# Altium schematic sheet LED_Fret.SchDoc
size Letter
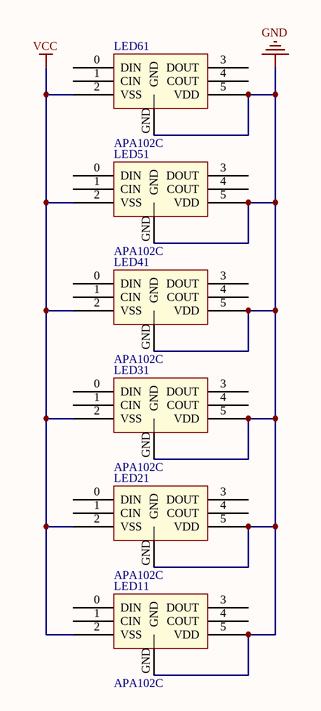
[diagram p0: LED_Fret.SchDoc]

## Parts
LED11  APA102C  [RGB LED]
LED21  APA102C  [RGB LED]
LED31  APA102C  [RGB LED]
LED41  APA102C  [RGB LED]
LED51  APA102C  [RGB LED]
LED61  APA102C  [RGB LED]

## Nets
GND: LED11.5(VDD) LED11.GND LED21.5(VDD) LED21.GND LED31.5(VDD) LED31.GND LED41.5(VDD) LED41.GND LED51.5(VDD) LED51.GND LED61.5(VDD) LED61.GND
VCC: LED11.2(VSS) LED21.2(VSS) LED31.2(VSS) LED41.2(VSS) LED51.2(VSS) LED61.2(VSS)

Not connected (* = marked no-connect by the designer): LED11 0(DIN) 1(CIN) 3(DOUT) 4(COUT); LED21 0(DIN) 1(CIN) 3(DOUT) 4(COUT); LED31 0(DIN) 1(CIN) 3(DOUT) 4(COUT); LED41 0(DIN) 1(CIN) 3(DOUT) 4(COUT); LED51 0(DIN) 1(CIN) 3(DOUT) 4(COUT); LED61 0(DIN) 1(CIN) 3(DOUT) 4(COUT)

## Library data of the parts
LED11 LED21 LED31 LED41 LED51 LED61 = RGB LED